# EAGLE design MainBoardR3 (EAGLE 6.4)
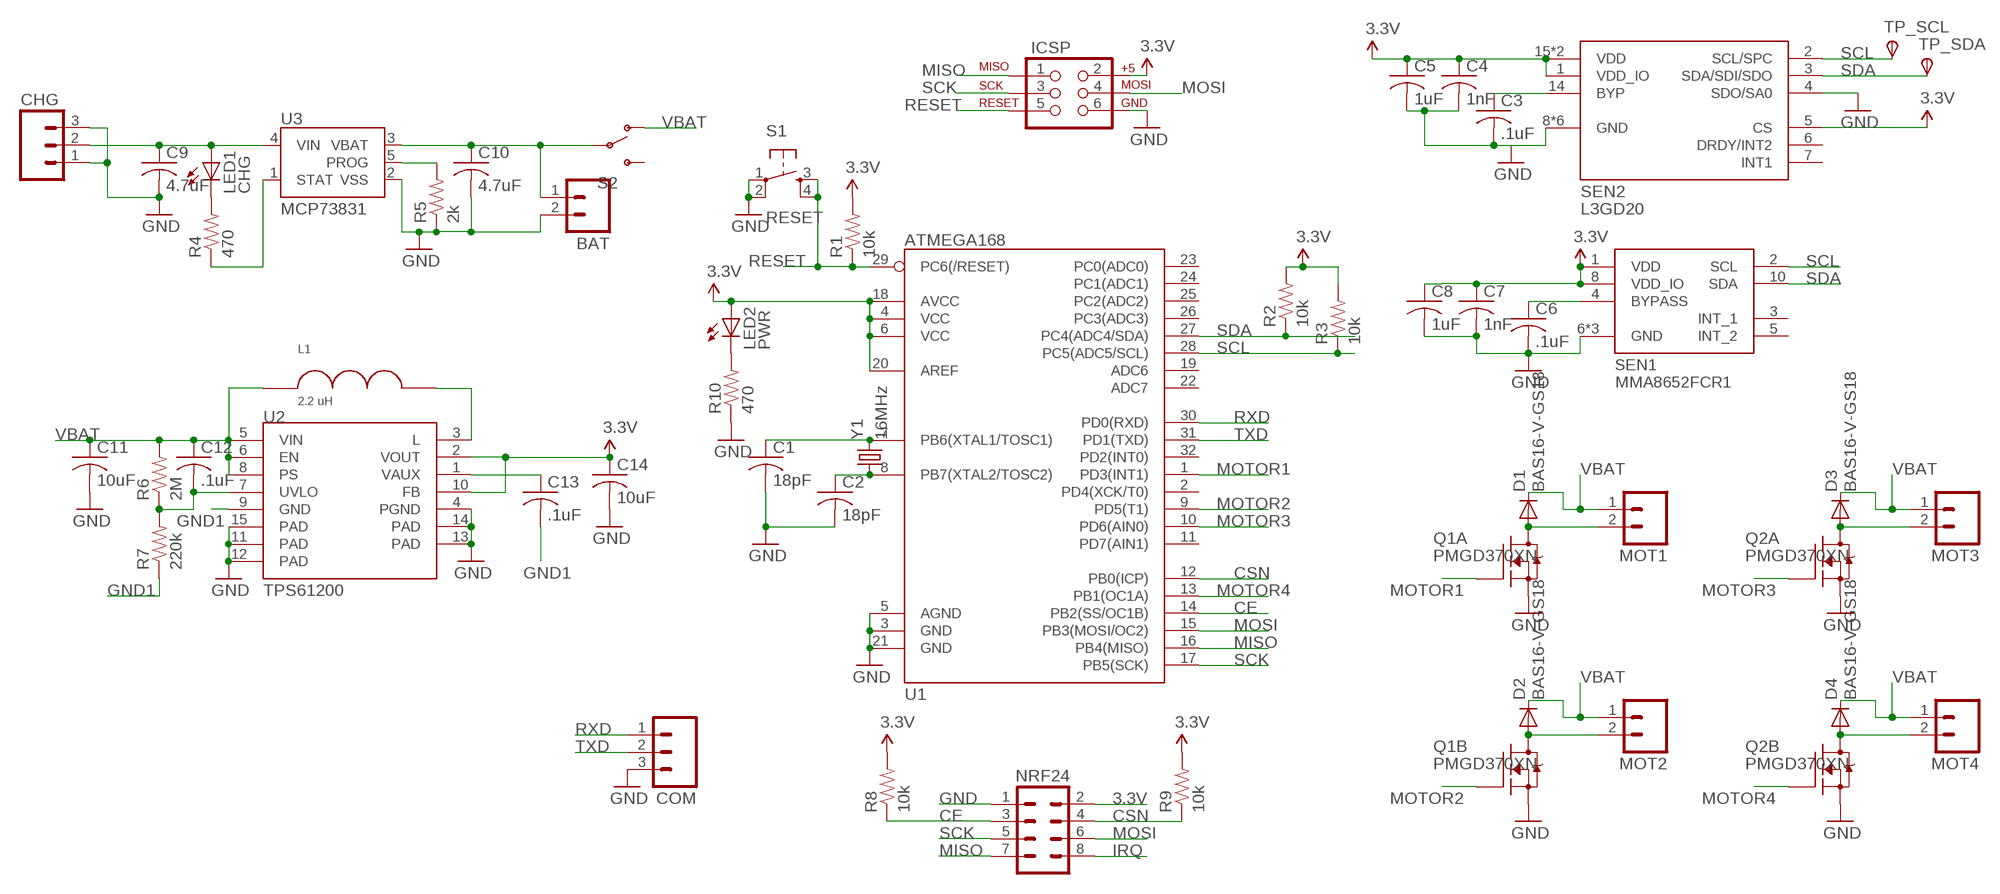
[diagram p0: schematic, sheet 1]

## Parts
BAT  M02LOCK_LONGPADS  [1X02_LOCK_LONGPADS]
C1  18pF  C-USC0805  [C0805]
C2  18pF  C-USC0805  [C0805]
C3  .1uF  C-USC0805  [C0805]
C4  1nF  C-USC0805  [C0805]
C5  1uF  C-USC0805  [C0805]
C6  .1uF  C-USC0805  [C0805]
C7  1nF  C-USC0805  [C0805]
C8  1uF  C-USC0805  [C0805]
C9  4.7uF  C-USC0805  [C0805]
C10  4.7uF  C-USC0805  [C0805]
C11  10uF  C-USC0805  [C0805]
C12  .1uF  C-USC0805  [C0805]
C13  .1uF  C-USC0805  [C0805]
C14  10uF  C-USC0805  [C0805]
CHG  M03LONGPADS  [1X03_LONGPADS]
COM  M03LONGPADS  [1X03_LONGPADS]
D1  BAS16-V-GS18  [SOT23]
D2  BAS16-V-GS18  [SOT23]
D3  BAS16-V-GS18  [SOT23]
D4  BAS16-V-GS18  [SOT23]
ICSP  AVR_SPI_PRG_62X3_LOCK  [2X3_LOCK]
L1  2.2 uH  BRHL2518T2R2M  [2518]
LED1  CHG  LED1206  [LED-1206]
LED2  PWR  LED1206  [LED-1206]
MOT1  M02LOCK_LONGPADS  [1X02_LOCK_LONGPADS]
MOT2  M02LOCK_LONGPADS  [1X02_LOCK_LONGPADS]
MOT3  M02LOCK_LONGPADS  [1X02_LOCK_LONGPADS]
MOT4  M02LOCK_LONGPADS  [1X02_LOCK_LONGPADS]
NRF24  M04X2  [2X4]
Q1  PMGD370XN  [SOT363_INFINEON]
Q2  PMGD370XN  [SOT363_INFINEON]
R1  10k  RESISTOR0805-RES  [0805]
R2  10k  RESISTOR0805-RES  [0805]
R3  10k  RESISTOR0805-RES  [0805]
R4  470  RESISTOR0805-RES  [0805]
R5  2k  RESISTOR0805-RES  [0805]
R6  2M  RESISTOR0805-RES  [0805]
R7  220k  RESISTOR0805-RES  [0805]
R8  10k  RESISTOR0805-RES  [0805]
R9  10k  RESISTOR0805-RES  [0805]
R10  470  RESISTOR0805-RES  [0805]
S1  RESET  TAC_SWITCHSMD  [TACTILE_SWITCH_SMD]
S2  SWITCH-SPST-SMD-A  [SWITCH-SPST-SMD-A]
SEN1  MMA8652FCR1  [10_PIN_DFN]
SEN2  L3GD20  [LGA-16]
TP_SCL  TPSTP14SQ  [TP14SQ]
TP_SDA  TPSTP14SQ  [TP14SQ]
U1  ATMEGA168  [TQFP32-08]
U2  TPS61200  [QFN-10_PAD]
U3  MCP73831  [SOT23-5]
Y1  16MHz  CRYSTAL10.5X4.8  [CRYSTAL-SMD-10.5X4.8-2PIN]

## Nets
3.3V: C4.1 C5.1 C7.1 C8.1 C14.1 ICSP.2 LED2.A NRF24.2 R1.2 R2.2 R3.2 R8.2 R9.2 SEN1.1(VDD) SEN1.8(VDD_IO) SEN2.1(VDD_IO) SEN2.5(CS) SEN2.15(VDD) SEN2.16(VDD) U1.4(VCC) U1.6(VCC) U1.18(AVCC) U1.20(AREF) U2.2(VOUT) U2.10(FB)
BAT+: BAT.1 C10.1 S2.2(P) U3.3(VBAT)
CE: NRF24.3 R8.1 U1.14(PB2(SS/OC1B))
CSN: NRF24.4 R9.1 U1.12(PB0(ICP))
GND: BAT.2 C1.2 C2.2 C3.2 C4.2 C5.2 C6.2 C7.2 C8.2 C9.2 C10.2 C11.2 C14.2 CHG.1 CHG.3 COM.3 ICSP.6 NRF24.1 Q1.1(A:S) Q1.4(B:S) Q2.1(A:S) Q2.4(B:S) R5.1 R10.1 S1.1 S1.2 SEN1.6(GND) SEN1.7(GND) SEN1.9(GND) SEN2.4(SDO/SA0) SEN2.8(GND) SEN2.9(GND) SEN2.10(GND) SEN2.11(GND) SEN2.12(GND) SEN2.13(GND) U1.3(GND) U1.5(AGND) U1.21(GND) U2.4(PGND) U2.11(PAD) U2.12(PAD) U2.13(PAD) U2.14(PAD) U2.15(PAD) U3.2(VSS)
GND1: C13.2 R7.1 U2.9(GND)
IRQ: NRF24.8
MISO: ICSP.1 NRF24.7 U1.16(PB4(MISO))
MOSI: ICSP.4 NRF24.6 U1.15(PB3(MOSI/OC2))
MOT1-: D1.1(A) MOT1.2 Q1.6(A:D)
MOT2-: D2.1(A) MOT2.2 Q1.3(B:D)
MOT3-: D3.1(A) MOT3.2 Q2.6(A:D)
MOT4-: D4.1(A) MOT4.2 Q2.3(B:D)
MOTOR1: Q1.2(A:G) U1.1(PD3(INT1))
MOTOR2: Q1.5(B:G) U1.9(PD5(T1))
MOTOR3: Q2.2(A:G) U1.10(PD6(AIN0))
MOTOR4: Q2.5(B:G) U1.13(PB1(OC1A))
N$1: C3.1 SEN2.14(BYP)
N$2: C1.1 U1.7(PB6(XTAL1/TOSC1)) Y1.P$2
N$3: C2.1 U1.8(PB7(XTAL2/TOSC2)) Y1.P$1
N$5: LED1.C R4.2
N$6: C6.1 SEN1.4(BYPASS)
N$10: R4.1 U3.1(STAT)
N$12: R5.2 U3.5(PROG)
N$13: C13.1 U2.1(VAUX)
N$14: C12.2 R6.1 R7.2 U2.7(UVLO)
N$15: LED2.C R10.2
N$16: L1.P$2 U2.3(L)
RESET: ICSP.5 R1.1 S1.3 S1.4 U1.29(PC6(/RESET))
RXD: COM.1 U1.30(PD0(RXD))
SCK: ICSP.3 NRF24.5 U1.17(PB5(SCK))
SCL: R3.1 SEN1.2(SCL) SEN2.2(SCL/SPC) TP_SCL.TP(PP) U1.28(PC5(ADC5/SCL))
SDA: R2.1 SEN1.10(SDA) SEN2.3(SDA/SDI/SDO) TP_SDA.TP(PP) U1.27(PC4(ADC4/SDA))
TXD: COM.2 U1.31(PD1(TXD))
VBAT: C11.1 C12.1 D1.3(C) D2.3(C) D3.3(C) D4.3(C) L1.P$1 MOT1.1 MOT2.1 MOT3.1 MOT4.1 R6.2 S2.1(O) U2.5(VIN) U2.6(EN) U2.8(PS)
VIN: C9.1 CHG.2 LED1.A U3.4(VIN)
Unconnected: S2.3(S) SEN1.3(INT_1) SEN1.5(INT_2) SEN2.6(DRDY/INT2) SEN2.7(INT1) U1.2(PD4(XCK/T0)) U1.11(PD7(AIN1)) U1.19(ADC6) U1.22(ADC7) U1.23(PC0(ADC0)) U1.24(PC1(ADC1)) U1.25(PC2(ADC2)) U1.26(PC3(ADC3)) U1.32(PD2(INT0))

## Library data of the parts
BAT MOT1-MOT4 = SparkFun:M02: Header 2 Standard 2-pin 0.1" header. Use with straight break away headers (SKU : PRT-00116), right angle break away headers (PRT-00553), swiss pins (PRT-00743), machine pins (PRT-00117), and female headers (PRT-00115). Molex polarized connector foot print use with SKU : PRT-08233 with associated crimp pins and housings.
C1-C14 = rcl:C-US: CAPACITOR, American symbol
CHG COM = SparkFun:M03: Header 3 Standard 3-pin 0.1" header. Use with straight break away headers (SKU : PRT-00116), right angle break away headers (PRT-00553), swiss pins (PRT-00743), machine pins (PRT-00117), and female headers (PRT-00115). Molex polarized connector foot print use with SKU : PRT-08232 with associated crimp pins and housings.
D1-D4 = diode:BAS16-V-GS18
ICSP = SparkFun:AVR_SPI_PRG_6: AVR ISP 6 Pin This is the reduced ISP connector for AVR programming. Common on Arduino. This footprint will take up less PCB space and can be used with a 10-pin to 6-pin adapter such as SKU: BOB-08508
L1 = inductors:BRHL2518T2R2M
LED1 LED2 = SparkFun:LED: LEDs Standard schematic elements and footprints for 5mm, 3mm, 1206, and 0603 sized LEDs. 5mm - Spark Fun Electronics SKU : COM-00529 (and others)
NRF24 = SparkFun:M04X2
Q1 Q2 = transistor-fet:PMGD370XN: N-Channel Power MOSFET
R1-R10 = SparkFun:RESISTOR: Resistor Basic schematic elements and footprints for 0603, 1206, and PTH resistors.
S1 = SparkFun:TAC_SWITCH: Momentary Switch Button commonly used for reset or general input. Spark Fun Electronics SKU : COM-00097
S2 = SparkFun:SWITCH-SPST: SPST Switch Simple slide switch. Spark Fun Electronics SKU : COM-00102
SEN1 = Sensors:MMA8652FCR1
SEN2 = Sensors:L3GD20
TP_SCL TP_SDA = testpad:TPS: TEST PIN
U1 = SparkFun:ATMEGA168
U2 = SparkFun:TPS61200: DC to DC Booster
U3 = SparkFun:MCP73831: Microchip's MCP73831 Miniature single cell, fully integrated Li-Ion, Li-polymer charge management controller http://ww1.microchip.com/downloads/en/DeviceDoc/21984a.pdf
Y1 = SparkFun:CRYSTAL: Crystals Various standard crystals. Proven footprints. Spark Fun Electronics SKU : COM-00534

## Board
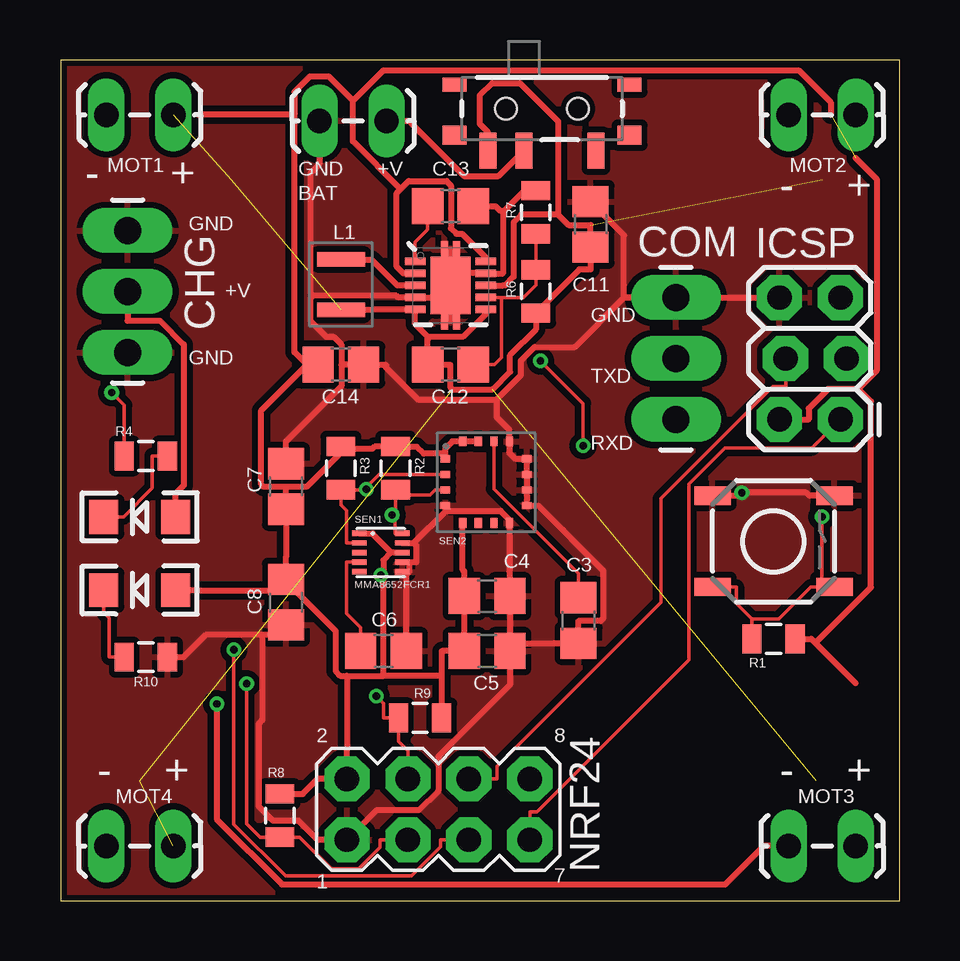
[diagram p1: board, top side]
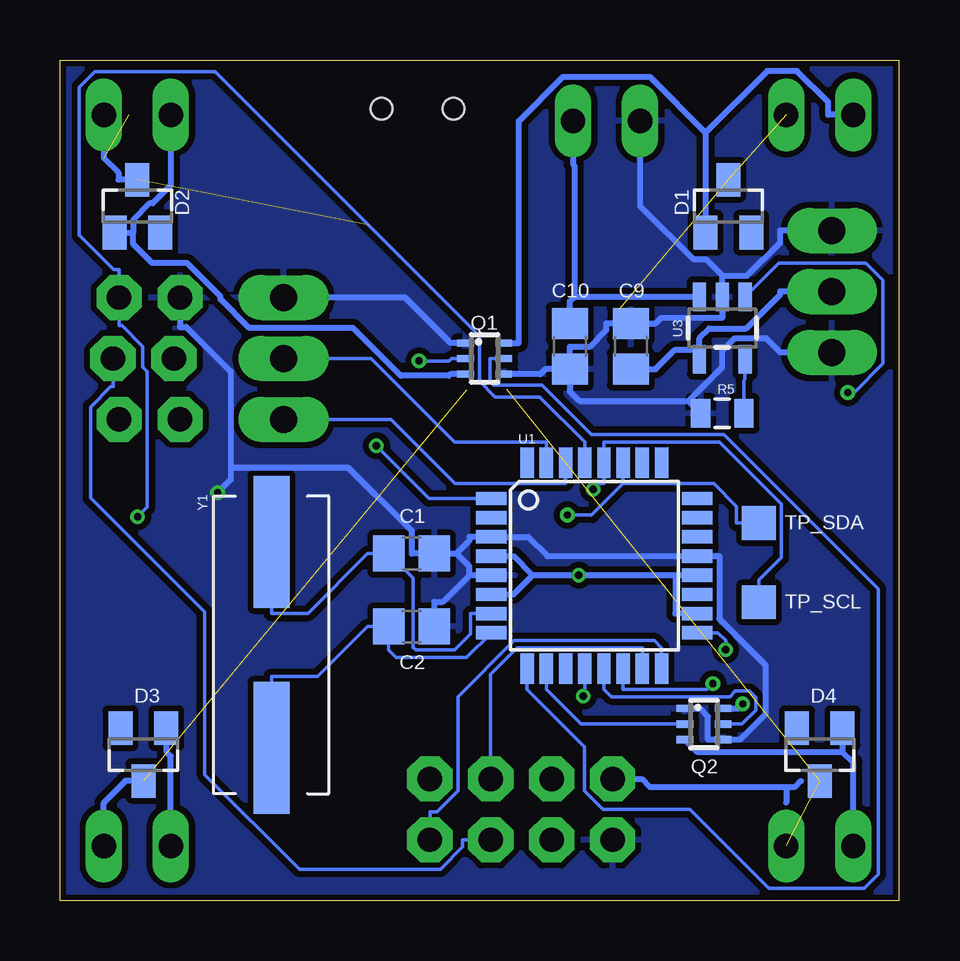
[diagram p2: board, bottom side, seen from below]

Size 34.98 x 35.04 mm. Coordinates in mm from the lower left corner, seen from the top.
Outline: 0,0 34.98,0 34.98,35.04 0,35.04 0,0
Copper layers (1*16): Top 0.035mm / dielectric 1.5mm / Bottom 0.035mm
Design rules "Fusion_eagle_rule_v1.1": minimum track width 6mil, minimum drill 12mil, track to track 6mil, track to pad 6mil, pad to pad 6mil, via to via 6mil, smd to smd 0mil, copper to edge 10mil, drill to drill 10mil, minimum pad ring 10mil, minimum via ring 6mil, stop-mask expansion 2mil, vias tented up to drill 100mil, thermal gap 10mil

### Footprints (pad centres in the part's own frame; a part is rotated, then mirrored left to right if it is on the bottom)
1X02_LOCK_LONGPADS = drill 1.016 long: 1 -0.127,0; 2 2.667,0
C0805 = smd 1.3 x 1.5: 1 -0.95,0; 2 0.95,0
1X03_LONGPADS = drill 1.118 pad 1.88 long: 1 0,0; 2 2.54,0; 3 5.08,0
SOT23 = smd 1 x 1.4: 1 -0.95,-1.1; 2 0.95,-1.1; 3 0,1.1
2X3_LOCK = drill 1.016 pad 1.88 octagon: 1 0,0; 2 0,2.54; 3 2.54,-0.254; 4 2.54,2.286; 5 5.08,0; 6 5.08,2.54
2518 = smd 0.6 x 2: P$1 0,0; P$2 2.1,0
LED-1206 = smd 1.2 x 1.4: A -1.5,0; C 1.5,0
2X4 = drill 1.016 pad 1.88 octagon: 1 -3.81,-1.27; 2 -3.81,1.27; 3 -1.27,-1.27; 4 -1.27,1.27; 5 1.27,-1.27; 6 1.27,1.27; 7 3.81,-1.27; 8 3.81,1.27
SOT363_INFINEON = smd 0.3 x 0.7: 1 -0.65,-0.8; 2 0,-0.8; 3 0.65,-0.8; 4 0.65,0.8; 5 0,0.8; 6 -0.65,0.8
0805 = smd 0.8 x 1.2: 1 -0.9,0; 2 0.9,0
TACTILE_SWITCH_SMD = smd 1.524 x 0.762: 1 -2.54,1.905; 2 2.54,1.905; 3 -2.54,-1.905; 4 2.54,-1.905
SWITCH-SPST-SMD-A = smd 0.7 x 1.5: 1 -2.25,-1.75; 2 -0.75,-1.75; 3 2.25,-1.75 | smd 1 x 0.6: GND1 -3.65,1; GND3 3.65,1 | smd 1 x 0.8: GND2 -3.65,-1.1; GND4 3.65,-1.1 | hole 0.9: -1.5,0; 1.5,0
10_PIN_DFN = smd 0.6 x 0.225: 1 0,1.6; 2 0,1.2; 3 0,0.8; 4 0,0.4; 5 0,0; 6 1.8,0; 7 1.8,0.4; 8 1.8,0.8; 9 1.8,1.2; 10 1.8,1.6
LGA-16 = smd 0.4 x 0.3: 1 -0.725,2.675; 2 -0.725,2.025; 3 -0.725,1.375; 4 -0.725,0.725; 9 2.675,0.725; 10 2.675,1.375; 11 2.675,2.025; 12 2.675,2.675 | smd 0.3 x 0.4: 5 0,0; 6 0.65,0; 7 1.3,0; 8 1.95,0; 13 1.95,3.4; 14 1.3,3.4; 15 0.65,3.4; 16 0,3.4
TP14SQ = smd 1.4 x 1.4: TP 0,0
TQFP32-08 = smd 1.27 x 0.559: 1 -4.293,2.8; 2 -4.293,2; 3 -4.293,1.2; 4 -4.293,0.4; 5 -4.293,-0.4; 6 -4.293,-1.2; 7 -4.293,-2; 8 -4.293,-2.8; 17 4.293,-2.8; 18 4.293,-2; 19 4.293,-1.2; 20 4.293,-0.4; 21 4.293,0.4; 22 4.293,1.2; 23 4.293,2; 24 4.293,2.8 | smd 0.559 x 1.27: 9 -2.8,-4.293; 10 -2,-4.293; 11 -1.2,-4.293; 12 -0.4,-4.293; 13 0.4,-4.293; 14 1.2,-4.293; 15 2,-4.293; 16 2.8,-4.293; 25 2.8,4.293; 26 2,4.293; 27 1.2,4.293; 28 0.4,4.293; 29 -0.4,4.293; 30 -1.2,4.293; 31 -2,4.293; 32 -2.8,4.293
QFN-10_PAD = smd 0.297 x 0.85: 1 -1,-1.475; 2 -0.5,-1.475; 3 0,-1.475; 4 0.5,-1.475; 5 1,-1.475; 6 1,1.475; 7 0.5,1.475; 8 0,1.475; 9 -0.5,1.475; 10 -1,1.475 | smd 0.7 x 0.28: 11 -1.5,0.25; 12 -1.5,-0.25; 13 1.5,0.25; 14 1.5,-0.25 | smd 2.4 x 1.65: 15 0,0
SOT23-5 = smd 0.55 x 1.2: 1 -0.95,-1.3; 2 0,-1.3; 3 0.95,-1.3; 4 0.95,1.3; 5 -0.95,1.3
CRYSTAL-SMD-10.5X4.8-2PIN = smd 5.5 x 1.5: P$1 -4.3,0; P$2 4.3,0

### Placement (x,y rotation side)
BAT  13.46,32.51 180 top
C1  20.32,14.48 0 bottom
C2  20.32,11.43 0 bottom
C3  21.59,11.68 270 top
C4  17.78,12.7 0 top
C5  17.78,10.41 0 top
C6  13.46,10.41 0 top
C7  9.4,17.27 90 top
C8  9.4,12.45 270 top
C9  11.18,23.11 90 bottom
C10  13.72,23.11 270 bottom
C11  22.1,28.19 90 top
C12  16.26,22.35 0 top
C13  16.26,28.96 0 top
C14  11.68,22.35 0 top
CHG  2.79,22.86 90 top
COM  25.65,20.07 90 top
D1  7.11,28.96 0 bottom
D2  31.75,28.96 0 bottom
D3  31.5,6.1 180 bottom
D4  3.3,6.1 180 bottom
ICSP  32.51,20.07 90 top
L1  11.68,24.64 90 top
LED1  3.3,16 180 top
LED2  3.3,12.95 180 top
MOT1  4.57,32.77 180 top
MOT2  33.02,32.77 180 top
MOT3  33.02,2.29 180 top
MOT4  4.57,2.29 180 top
NRF24  15.75,3.81 0 top
Q1  17.27,22.61 270 bottom
Q2  8.13,7.37 270 bottom
R1  29.72,10.92 0 top
R2  13.97,18.03 90 top
R3  11.68,18.03 90 top
R4  3.56,18.54 0 top
R5  7.37,20.32 0 bottom
R6  19.81,25.4 270 top
R7  19.81,28.7 270 top
R8  9.14,3.56 90 top
R9  14.99,7.62 0 top
R10  3.56,10.16 180 top
S1  29.72,14.99 0 top
S2  20.07,33.02 0 top
SEN1  12.45,13.72 0 top
SEN2  16.76,15.75 0 top
TP_SCL  5.84,12.45 0 bottom
TP_SDA  5.84,15.75 0 bottom
U1  12.7,13.97 0 bottom
U2  16.26,25.65 270 top
U3  7.37,23.88 180 bottom
Y1  26.16,10.67 90 bottom

### Tracks (layer width: path | path; a pad name or v marks a point on that pad's centre or on a via)
3.3V  (via drill 0.3 pad 0.61)  (1 unrouted)
  Top 0.225: 13.91,14.52 SEN1.8
  Top 0.254: 12.19,33.36 11.19,34.36 10.39,34.36 9.75,33.73 9.75,32.77 | 14.18,29.68 12.19,31.66 12.19,33.36 | 12.19,33.36 13.46,34.62 30.77,34.62 32.1,33.29 32.1,32.77 | 14.18,29.68 14.51,30 16.09,30 16.28,29.82 16.28,28.03 16.5,27.8 16.74,27.8 17.73,26.81 U2.10 | U2.2 14.29,26.15 14.01,26.43 14.01,29.5 14.18,29.68 | 9.75,32.77 5.74,32.77 | 10.27,22.35 9.75,22.87 9.75,32.77 | 9.4,17.25 8.47,17.25 8.36,17.36 8.36,20.45 10.27,22.35 | 9.4,17.25 C7.1 9.4,14.32 C8.1 9.4,13.16 9.4,12.93 | C14.1 10.27,22.35 | SEN2.5 16.76,13.8 16.83,13.73 C4.1 C5.1 15.9,10.41 15.89,10.4 15.89,9.38 | 11.94,9.38 13.46,9.38 | 9.4,12.93 9.78,12.93 11.47,11.25 11.47,9.58 11.66,9.38 11.94,9.38 | 11.94,9.38 11.94,6.3 NRF24.2 10.72,5.08 10.1,4.46 R8.2 | 33.26,21.34 32,21.34 31.19,20.52 31.19,20.07 ICSP.2 | 33.15,30.96 34.02,30.09 34.02,22.1 33.26,21.34 | 31.47,10.75 33.78,13.06 33.78,20.81 33.26,21.34 | 31.47,10.75 31.3,10.92 R1.2 | 33.15,9.07 31.47,10.75 | 9.4,17.25 10.25,17.25 11.68,18.69 11.68,18.76 11.68,18.85 | SEN1.1 13.03,15.32 13.03,15.28 13.79,14.52 | 13.79,14.52 13.46,14.19 13.46,13.57 | 13.91,14.52 13.79,14.52 | 13.46,13.57 v13.35,13.57 | 13.46,9.38 13.46,13.57 | 11.68,18.85 13.01,18.85 13.09,18.93 R2.2 14.85,18.93 15.15,18.64 16.04,18.64 | R3.2 11.68,18.85 | 15.89,9.38 R9.2 | 15.89,9.38 13.46,9.38 | 9.4,12.93 5.7,12.93 5.68,12.95 LED2.A | 16.04,18.64 16.04,18.85 16.33,19.15 SEN2.16 SEN2.15 | SEN2.1 16.04,18.64
  Bottom 0.254: 15.28,13.57 16.08,14.37 U1.4 | 15.28,13.57 v13.35,13.57 9.32,13.57 | 15.28,13.57 16.08,12.77 U1.6 | 4.7,4.73 4.7,4.09 | 4.08,5 4.34,4.73 4.7,4.73 | 4.7,4.73 10.37,4.73 10.72,5.08 NRF24.2 | U1.20 9.32,13.57 | 9.32,13.57 9.32,11.97 U1.18
BAT+
  Top 0.254: BAT.1 14.63,32.51 14.63,32.4 16.82,30.21 18.26,30.21 S2.2
  Bottom 0.254: BAT.1 13.59,30.71 13.53,30.65 13.53,25.18 | 13.53,25.18 13.72,24.99 C10.1 | U3.3 13.53,25.18
CE  (via drill 0.3 pad 0.61)
  Top 0.152: NRF24.3 13.31,2.54 13.31,2.23 12.43,1.34 11.29,1.34 9.97,2.66 R8.1 8.31,2.66 7.76,3.21 v7.76,9.05
  Bottom 0.152: v7.76,9.05 8,8.81 11.5,8.81 U1.14
CSN  (via drill 0.3 pad 0.61)
  Top 0.152: v13.16,8.53 13.46,8.23 13.46,7.62 R9.1 14.09,6.64 14.48,6.25 NRF24.4
  Bottom 0.152: U1.12 13.1,8.59 v13.16,8.53
GND  (via drill 0.3 pad 0.61)
  Top 0.254: 18.73,10.73 C5.2 18.73,8.99 15.75,6.01 15.75,4.59 14.93,3.78 13.17,3.78 NRF24.1 10.72,2.54 9.91,3.35 8.85,3.35 8.26,3.94 8.26,7.38 8.41,7.53 8.41,11.08 | 8.41,11.08 6.05,11.08 5.14,10.16 R10.1 | C8.2 8.98,11.08 8.41,11.08 | C7.2 9.4,19.15 11.7,21.46 11.7,22.35 | 10.53,25.23 10.4,25.11 10.4,24.19 11.08,23.52 11.37,23.52 11.7,23.18 11.7,22.35 | S1.2 31.22,16.89 31.09,17.02 v28.4,17.02 28.34,17.02 28.22,16.89 S1.1 | 23.5,25.15 23.5,27.75 C11.2 | 23.5,25.15 COM.3 ICSP.6 | 18.18,20.89 19.19,21.91 19.19,22.52 19.77,23.09 21.44,23.09 23.5,25.15 | 16.04,16.26 16.04,16.23 14.72,14.92 | 16.04,16.26 18.34,16.26 18.71,15.88 SEN2.8 18.71,13.74 18.73,13.73 C4.2 18.73,10.73 | 14.72,14.92 14.82,14.81 14.82,14.12 14.54,14.12 | SEN2.4 16.04,16.26 | 18.18,20.89 14.9,20.89 13.56,22.24 13.56,22.35 C14.2 11.7,22.35 | 18.18,20.89 18.18,20.17 18.71,19.63 SEN2.13 18.71,18.67 18.96,18.42 SEN2.12 19.44,18.2 SEN2.11 SEN2.10 19.44,16.91 19.44,16.69 SEN2.9 19.92,16.47 22.62,13.77 22.62,11.76 22.52,11.66 21.59,11.66 C3.2 20.56,10.73 18.73,10.73 | BAT.2 10.79,30.71 10.4,30.32 10.4,25.35 10.53,25.23 | 10.53,25.23 14.01,25.23 14.08,25.15 U2.4 15.13,25.15 15.49,25.15 15.5,25.17 16.26,25.17 | U2.11 16.51,26.52 16.39,26.52 16.26,26.39 | 16.26,26.39 16.26,27.13 16.03,27.13 U2.12 | 16.26,26.39 U2.15 16.26,25.54 16.26,25.17 | 14.54,14.12 14.54,13.72 | SEN1.7 14.54,14.12 | SEN1.9 14.72,14.92 | 14.54,13.72 14.41,13.59 C6.2 | SEN1.6 14.54,13.72 | 16.26,25.17 16.26,24.91 | U2.13 16.51,24.78 16.39,24.78 16.26,24.91 | 16.26,24.91 16.26,24.17 16.03,24.17 U2.14
  Bottom 0.254: Q2.1 8.3,8.02 7.96,7.67 7.96,6.72 Q2.4 6.63,6.72 5.58,7.77 5.58,9.84 7.49,11.76 7.49,14.37 U1.21 14.66,14.37 15.46,15.17 U1.3 17.91,15.17 17.91,15.01 18.44,14.48 | 8.78,20.84 7.37,22.26 7.37,22.93 6.85,23.45 5.55,23.45 4.95,22.86 CHG.1 | 8.78,20.84 13.32,20.84 13.72,21.23 C10.2 | R5.1 8.78,20.84 | 7.37,26.06 7.37,25.29 U3.2 7.37,24.3 9.91,24.3 10.15,24.06 C9.2 12.21,24.06 12.21,23.77 12.88,23.09 13.72,23.09 C10.2 | BAT.2 10.79,28.97 8.57,26.74 8.05,26.74 7.37,26.06 | CHG.3 4.95,27.94 4.95,27.43 6.33,26.06 7.37,26.06 | 27.86,18.05 27.86,17.56 v28.4,17.02 | 27.86,18.05 27.86,22.07 29.72,23.93 29.97,23.93 ICSP.6 | 27.86,18.05 22.94,18.05 20.3,15.41 20.3,14.48 C1.2 18.44,14.48 | Q1.4 14.95,21.96 14.74,22.16 C10.2 | Q1.1 18.7,23.26 20.59,25.15 COM.3 | C2.2 19.37,12.46 19.02,12.46 17.91,13.57 | U1.5 17.91,13.57 | 17.91,13.57 17.91,13.95 18.44,14.48
  pour Bottom (isolate 0.254): 0,35.05 0,0 35.05,0 35.05,35.05
  pour Top (isolate 0.254): 0,35.05 0,0 35.05,0 35.05,35.05
GND1
  Top 0.254: 18.44,28.75 18.34,28.75 18.14,28.96 C13.2 | 18.44,28.75 18.48,28.75 19.33,29.6 R7.1 | 18.44,28.75 18.44,26.15 U2.9
MISO
  Top 0.152: NRF24.7 19.56,3.71 19.85,3.71 26.18,10.04 26.18,17.36 27.7,18.88 31.33,18.88 ICSP.1
  Bottom 0.152: U1.16 9.9,10.54 10.21,10.85 16.05,10.85 18.39,8.51 18.39,4.58 19.27,3.71 19.56,3.71 NRF24.7
MOSI
  Top 0.152: ICSP.4 30.23,21.44 29.69,21.44 25.02,16.77 25.02,12.44 18.19,5.6 18.19,5.08 NRF24.6
  Bottom 0.152: NRF24.6 17.02,6.25 17.02,9.45 15.92,10.54 10.7,10.54 U1.15
MOT1-
  Bottom 0.254: MOT1.2 2.95,32.77 2.95,33.29 4.25,34.59 5.49,34.59 8.06,32.02 | 8.06,32.02 D1.1 | 8.06,32.02 10.38,34.34 14.01,34.34 15.84,32.51 15.84,23.26 Q1.6
MOT2-
  Bottom 0.254: 31.92,27.86 31.92,27.37 31.14,26.59 29.68,26.59 28.28,25.19 28.28,25.08 27.08,23.88 22.77,23.88 20.78,21.89 18.77,21.89 18.7,21.96 Q1.3 | MOT2.2 30.35,29.83 31.11,29.08 31.23,29.08 31.92,28.38 31.92,27.86 | D2.1 31.92,27.86
MOT3-  (via drill 0.3 pad 0.61)
  Top 0.254: v6.51,8.21 6.51,3.4 9.23,0.68 27.71,0.68 29.31,2.29 MOT3.2
  Bottom 0.254: D3.1 30.55,6.22 30.35,6.02 MOT3.2 | Q2.6 6.7,8.02 v6.51,8.21
MOT4-
  Bottom 0.254: Q2.3 8.43,6.22 2.35,6.22 | D4.1 2.35,6.22 | MOT4.2 1.91,5.77 2.35,6.22
MOTOR1  (via drill 0.3 pad 0.61)
  Top 0.152: v21.78,18.97 21.78,20.73 v20.01,22.51
  Bottom 0.152: Q1.2 18.65,22.61 18.75,22.51 v20.01,22.51 | U1.1 19.59,16.77 v21.78,18.97
MOTOR2
  Bottom 0.152: Q1.5 17.05,22.61 17.05,21.65 16.91,21.5 14.89,21.5 12.81,19.43 7.31,19.43 0.87,13 0.87,1.09 1.45,0.52 5.43,0.52 8.72,3.81 12.34,3.81 13.11,4.57 13.11,6.42 15.5,8.81 U1.9
MOTOR3
  Bottom 0.152: U1.10 14.7,8.81 13.25,7.37 Q2.2
MOTOR4
  Bottom 0.152: U1.13 12.3,8.81 11.99,8.51 7.05,8.51 6.81,8.75 6.25,8.75 5.97,8.47 5.97,7.94 6.54,7.37 Q2.5
N$1
  Top 0.152: SEN2.14 18.06,17.17 21.59,13.65 C3.1
N$2
  Bottom 0.152: U1.7 17.86,11.97 17.86,11.12 18.52,10.45 20.14,10.45 20.25,10.56 20.25,13.46 C1.1 22.15,14.48 24.64,11.99 26.16,11.99 Y1.P$2
N$3
  Bottom 0.152: U1.8 18.02,10.14 20.96,10.14 21.27,10.45 C2.1 22.15,11.43 24.23,9.35 26.16,9.35 Y1.P$1
N$5
  Top 0.152: LED1.C 2.63,16 3.83,17.2 3.83,18.54 R4.2
N$6
  Top 0.152: C6.1 12.51,11.39 11.92,11.99 11.92,14.12 SEN1.4
N$10  (via drill 0.3 pad 0.61)
  Top 0.152: R4.1 2.66,20.67 v2.13,21.19
  Bottom 0.152: U3.1 5.01,26.59 1.37,26.59 0.67,25.88 0.67,22.39 1.87,21.19 v2.13,21.19
N$12
  Bottom 0.152: U3.5 6.42,21.75 6.47,21.7 R5.2
N$13
  Top 0.152: C13.1 15.31,27.98 14.78,27.45 U2.1
N$14
  Top 0.152: 18.39,25.15 19.3,25.15 19.81,25.67 R6.1 R7.2 | C12.2 18.09,22.35 18.39,22.65 18.39,25.15 | U2.7 18.39,25.15
N$15
  Top 0.152: LED2.C 1.8,12.03 2.03,11.8 2.03,10.16 R10.2
N$16
  Top 0.254: L1.P$2 12.96,26.74 14.05,25.65 U2.3
N$17
  Top 0.254: 17.53,26.16 16.76,26.16
RESET  (via drill 0.3 pad 0.61)
  Top 0.152: 31.74,13.08 31.27,13.08 29.94,11.75 28.82,11.75 | S1.4 31.74,13.08 | v31.74,16.01 31.74,13.08 | S1.3 28.17,13.08 28.17,12.4 28.82,11.75 | R1.1 28.82,11.75
  Bottom 0.152: U1.29 13.1,19.13 14.98,21.01 16.84,21.01 17.49,21.66 17.49,23.55 28.51,34.57 33.53,34.57 34.17,33.92 34.17,27.75 32.73,26.31 32.51,26.31 ICSP.5 32.51,23.98 32.39,23.98 31.52,23.11 31.52,22.25 31.34,22.06 31.34,16.41 v31.74,16.01
RXD
  Bottom 0.152: U1.30 13.9,17.4 18.5,17.4 21.17,20.07 COM.1
SCK  (via drill 0.3 pad 0.61)
  Top 0.152: NRF24.5 15.85,2.54 15.85,2.25 14.64,1.04 9.38,1.04 7.22,3.19 v7.22,10.46
  Bottom 0.152: ICSP.3 32.77,21.44 32.85,21.44 33.7,20.59 33.7,16.79 28.94,12.03 28.94,5.26 24.99,1.32 19.12,1.32 18.19,2.25 18.19,2.54 NRF24.5 | v7.22,10.46 7.22,10.85 7.54,11.17 U1.17
SCL  (via drill 0.3 pad 0.61)
  Top 0.152: SEN1.2 11.92,14.92 11.92,16.27 11.68,16.5 R3.1 12.51,17.13 12.54,17.16 v12.75,17.16 12.75,17.24 13.28,17.77 SEN2.2
  Bottom 0.152: v12.75,17.16 12.51,17.4 12.3,17.4 12.3,17.83 U1.28 12.3,19.13 7.49,19.13 4.91,16.55 4.91,14.3 5.84,13.38 TP_SCL.TP
SDA  (via drill 0.3 pad 0.61)
  Top 0.152: SEN2.3 15.61,17.12 15.4,16.92 13.97,16.92 | 13.97,16.92 13.97,16.5 13.97,16.23 v13.82,16.08 13.94,15.96 13.94,15.32 SEN1.10 | R2.1 13.97,16.92
  Bottom 0.152: 11.5,17.4 12.82,16.08 v13.82,16.08 | 11.5,17.4 11.5,17.48 U1.27 | TP_SDA.TP 6.77,15.75 6.77,16.45 7.72,17.4 11.5,17.4
TXD
  Bottom 0.152: U1.31 14.7,19.13 18.52,19.13 22,22.61 COM.2
VBAT  (6 unrouted)
  Top 0.254: 14.78,24.64 U2.5 | 15.31,23.52 14.78,24.05 14.78,24.64 | 14.78,24.64 12.96,24.64 L1.P$1 | 15.31,23.52 16.79,23.52 17.73,24.46 U2.6 | 15.31,23.52 15.31,23.38 15.31,22.87 C12.1 16.23,22.35 16.23,21.42 16.34,21.32 18,21.32 18.74,22.06 18.74,22.75 19.81,23.82 R6.2 21.63,26.31 22.1,26.31 C11.1 22.1,28.17 21.17,28.17 20.73,28.61 | 20.73,28.61 20.73,32.5 19.15,34.09 18,34.09 17.48,33.57 17.48,32.38 17.82,32.05 S2.1 | 20.73,28.61 19.21,28.61 18.89,28.28 18.89,26.01 18.53,25.65 18.44,25.65 U2.8
  Bottom 0.254: D3.3 32.28,5 32.28,4.96 33.15,4.09 MOT3.1 | D2.3 32.53,30.06 32.53,30.34 33.15,30.96 MOT2.1
VIN
  Top 0.254: LED1.A 4.8,16.98 5.14,17.32 5.14,23.19 4.15,24.18 2.79,24.18 CHG.2
  Bottom 0.254: C9.1 10.15,22.16 9.35,22.96 8.32,22.96 | 8.32,22.96 8.32,23.45 7.91,23.86 6.37,23.86 4.95,25.27 4.95,25.4 CHG.2 | U3.4 8.32,22.96

### Text on the board
tPlace: - | + | GND | +V | - | + | GND | +V | GND | GND | TXD | RXD | 2 | 8 | - | + | - | + | 1 | 7